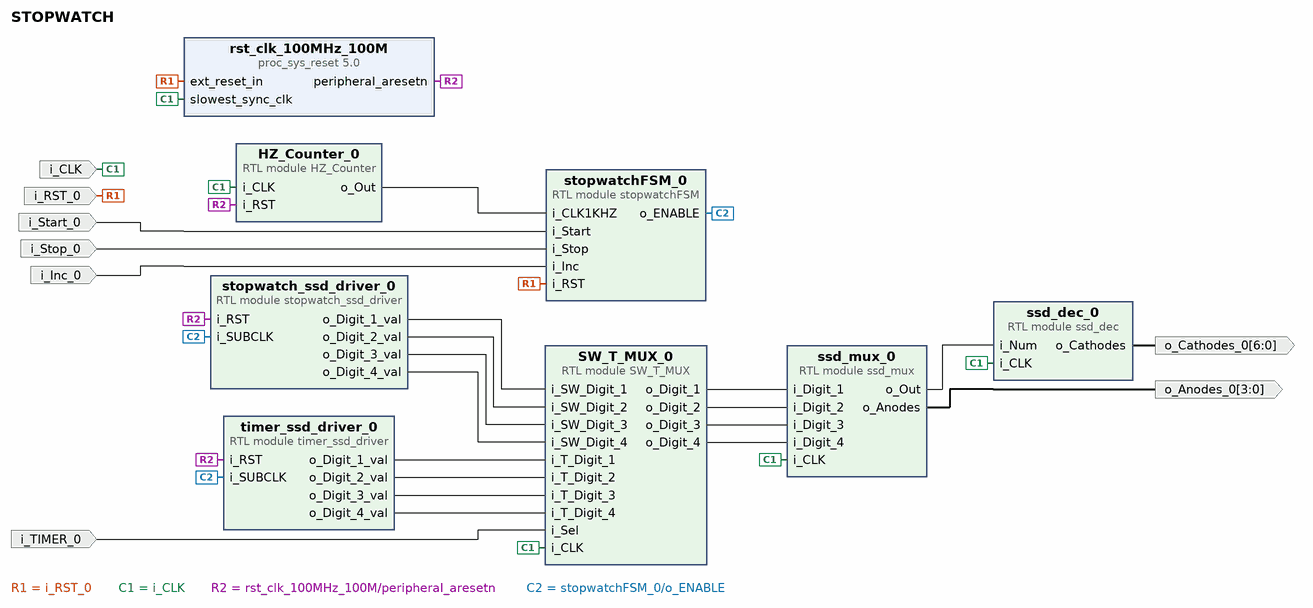
[diagram p0: block diagram of the top level]
# Vivado block design STOPWATCH, xc7z007sclg400-1, Vivado 2018.2
create_bd_design STOPWATCH

create_bd_port -dir I -type rst i_RST_0
create_bd_port -dir I i_Start_0
create_bd_port -dir I i_Stop_0
create_bd_port -dir I i_Inc_0
create_bd_port -dir I -type clk i_CLK
set_property -dict {CONFIG.FREQ_HZ 100000000} [get_bd_ports i_CLK]
create_bd_port -dir O -from 6 -to 0 o_Cathodes_0
create_bd_port -dir O -from 3 -to 0 o_Anodes_0
create_bd_port -dir I i_TIMER_0

create_bd_cell -type module -reference HZ_Counter HZ_Counter_0
set_property -dict {CONFIG.c_NUM 500000} [get_bd_cells HZ_Counter_0]
create_bd_cell -type ip -vlnv xilinx.com:ip:proc_sys_reset:5.0 rst_clk_100MHz_100M
create_bd_cell -type module -reference ssd_mux ssd_mux_0
create_bd_cell -type module -reference ssd_dec ssd_dec_0
create_bd_cell -type module -reference stopwatch_ssd_driver stopwatch_ssd_driver_0
create_bd_cell -type module -reference stopwatchFSM stopwatchFSM_0
create_bd_cell -type module -reference timer_ssd_driver timer_ssd_driver_0
create_bd_cell -type module -reference SW_T_MUX SW_T_MUX_0

# ---- connections ----

connect_bd_net -net i_RST_0_1 [get_bd_ports i_RST_0] [get_bd_pins rst_clk_100MHz_100M/ext_reset_in] [get_bd_pins stopwatchFSM_0/i_RST]
connect_bd_net -net i_Start_0_1 [get_bd_ports i_Start_0] [get_bd_pins stopwatchFSM_0/i_Start]
connect_bd_net -net i_Stop_0_1 [get_bd_ports i_Stop_0] [get_bd_pins stopwatchFSM_0/i_Stop]
connect_bd_net -net i_Inc_0_1 [get_bd_ports i_Inc_0] [get_bd_pins stopwatchFSM_0/i_Inc]
connect_bd_net -net clk_100MHz_1 [get_bd_ports i_CLK] \
  [get_bd_pins HZ_Counter_0/i_CLK] [get_bd_pins rst_clk_100MHz_100M/slowest_sync_clk] [get_bd_pins ssd_mux_0/i_CLK] \
  [get_bd_pins ssd_dec_0/i_CLK] [get_bd_pins SW_T_MUX_0/i_CLK]
connect_bd_net [get_bd_pins HZ_Counter_0/o_Out] [get_bd_pins stopwatchFSM_0/i_CLK1KHZ]
connect_bd_net [get_bd_pins rst_clk_100MHz_100M/peripheral_aresetn] \
  [get_bd_pins HZ_Counter_0/i_RST] [get_bd_pins stopwatch_ssd_driver_0/i_RST] [get_bd_pins timer_ssd_driver_0/i_RST]
connect_bd_net [get_bd_pins ssd_mux_0/o_Out] [get_bd_pins ssd_dec_0/i_Num]
connect_bd_net [get_bd_pins ssd_dec_0/o_Cathodes] [get_bd_ports o_Cathodes_0]
connect_bd_net [get_bd_pins ssd_mux_0/o_Anodes] [get_bd_ports o_Anodes_0]
connect_bd_net [get_bd_pins stopwatchFSM_0/o_ENABLE] [get_bd_pins stopwatch_ssd_driver_0/i_SUBCLK] [get_bd_pins timer_ssd_driver_0/i_SUBCLK]
connect_bd_net [get_bd_pins stopwatch_ssd_driver_0/o_Digit_1_val] [get_bd_pins SW_T_MUX_0/i_SW_Digit_1]
connect_bd_net [get_bd_pins stopwatch_ssd_driver_0/o_Digit_2_val] [get_bd_pins SW_T_MUX_0/i_SW_Digit_2]
connect_bd_net [get_bd_pins stopwatch_ssd_driver_0/o_Digit_3_val] [get_bd_pins SW_T_MUX_0/i_SW_Digit_3]
connect_bd_net [get_bd_pins stopwatch_ssd_driver_0/o_Digit_4_val] [get_bd_pins SW_T_MUX_0/i_SW_Digit_4]
connect_bd_net [get_bd_pins timer_ssd_driver_0/o_Digit_1_val] [get_bd_pins SW_T_MUX_0/i_T_Digit_1]
connect_bd_net [get_bd_pins timer_ssd_driver_0/o_Digit_2_val] [get_bd_pins SW_T_MUX_0/i_T_Digit_2]
connect_bd_net [get_bd_pins timer_ssd_driver_0/o_Digit_3_val] [get_bd_pins SW_T_MUX_0/i_T_Digit_3]
connect_bd_net [get_bd_pins timer_ssd_driver_0/o_Digit_4_val] [get_bd_pins SW_T_MUX_0/i_T_Digit_4]
connect_bd_net [get_bd_pins SW_T_MUX_0/o_Digit_1] [get_bd_pins ssd_mux_0/i_Digit_1]
connect_bd_net [get_bd_pins SW_T_MUX_0/o_Digit_2] [get_bd_pins ssd_mux_0/i_Digit_2]
connect_bd_net [get_bd_pins SW_T_MUX_0/o_Digit_3] [get_bd_pins ssd_mux_0/i_Digit_3]
connect_bd_net [get_bd_pins SW_T_MUX_0/o_Digit_4] [get_bd_pins ssd_mux_0/i_Digit_4]
connect_bd_net -net i_TIMER_0_1 [get_bd_ports i_TIMER_0] [get_bd_pins SW_T_MUX_0/i_Sel]

validate_bd_design
save_bd_design
